# Altium project Ad - ESP-12F.PrjPcb
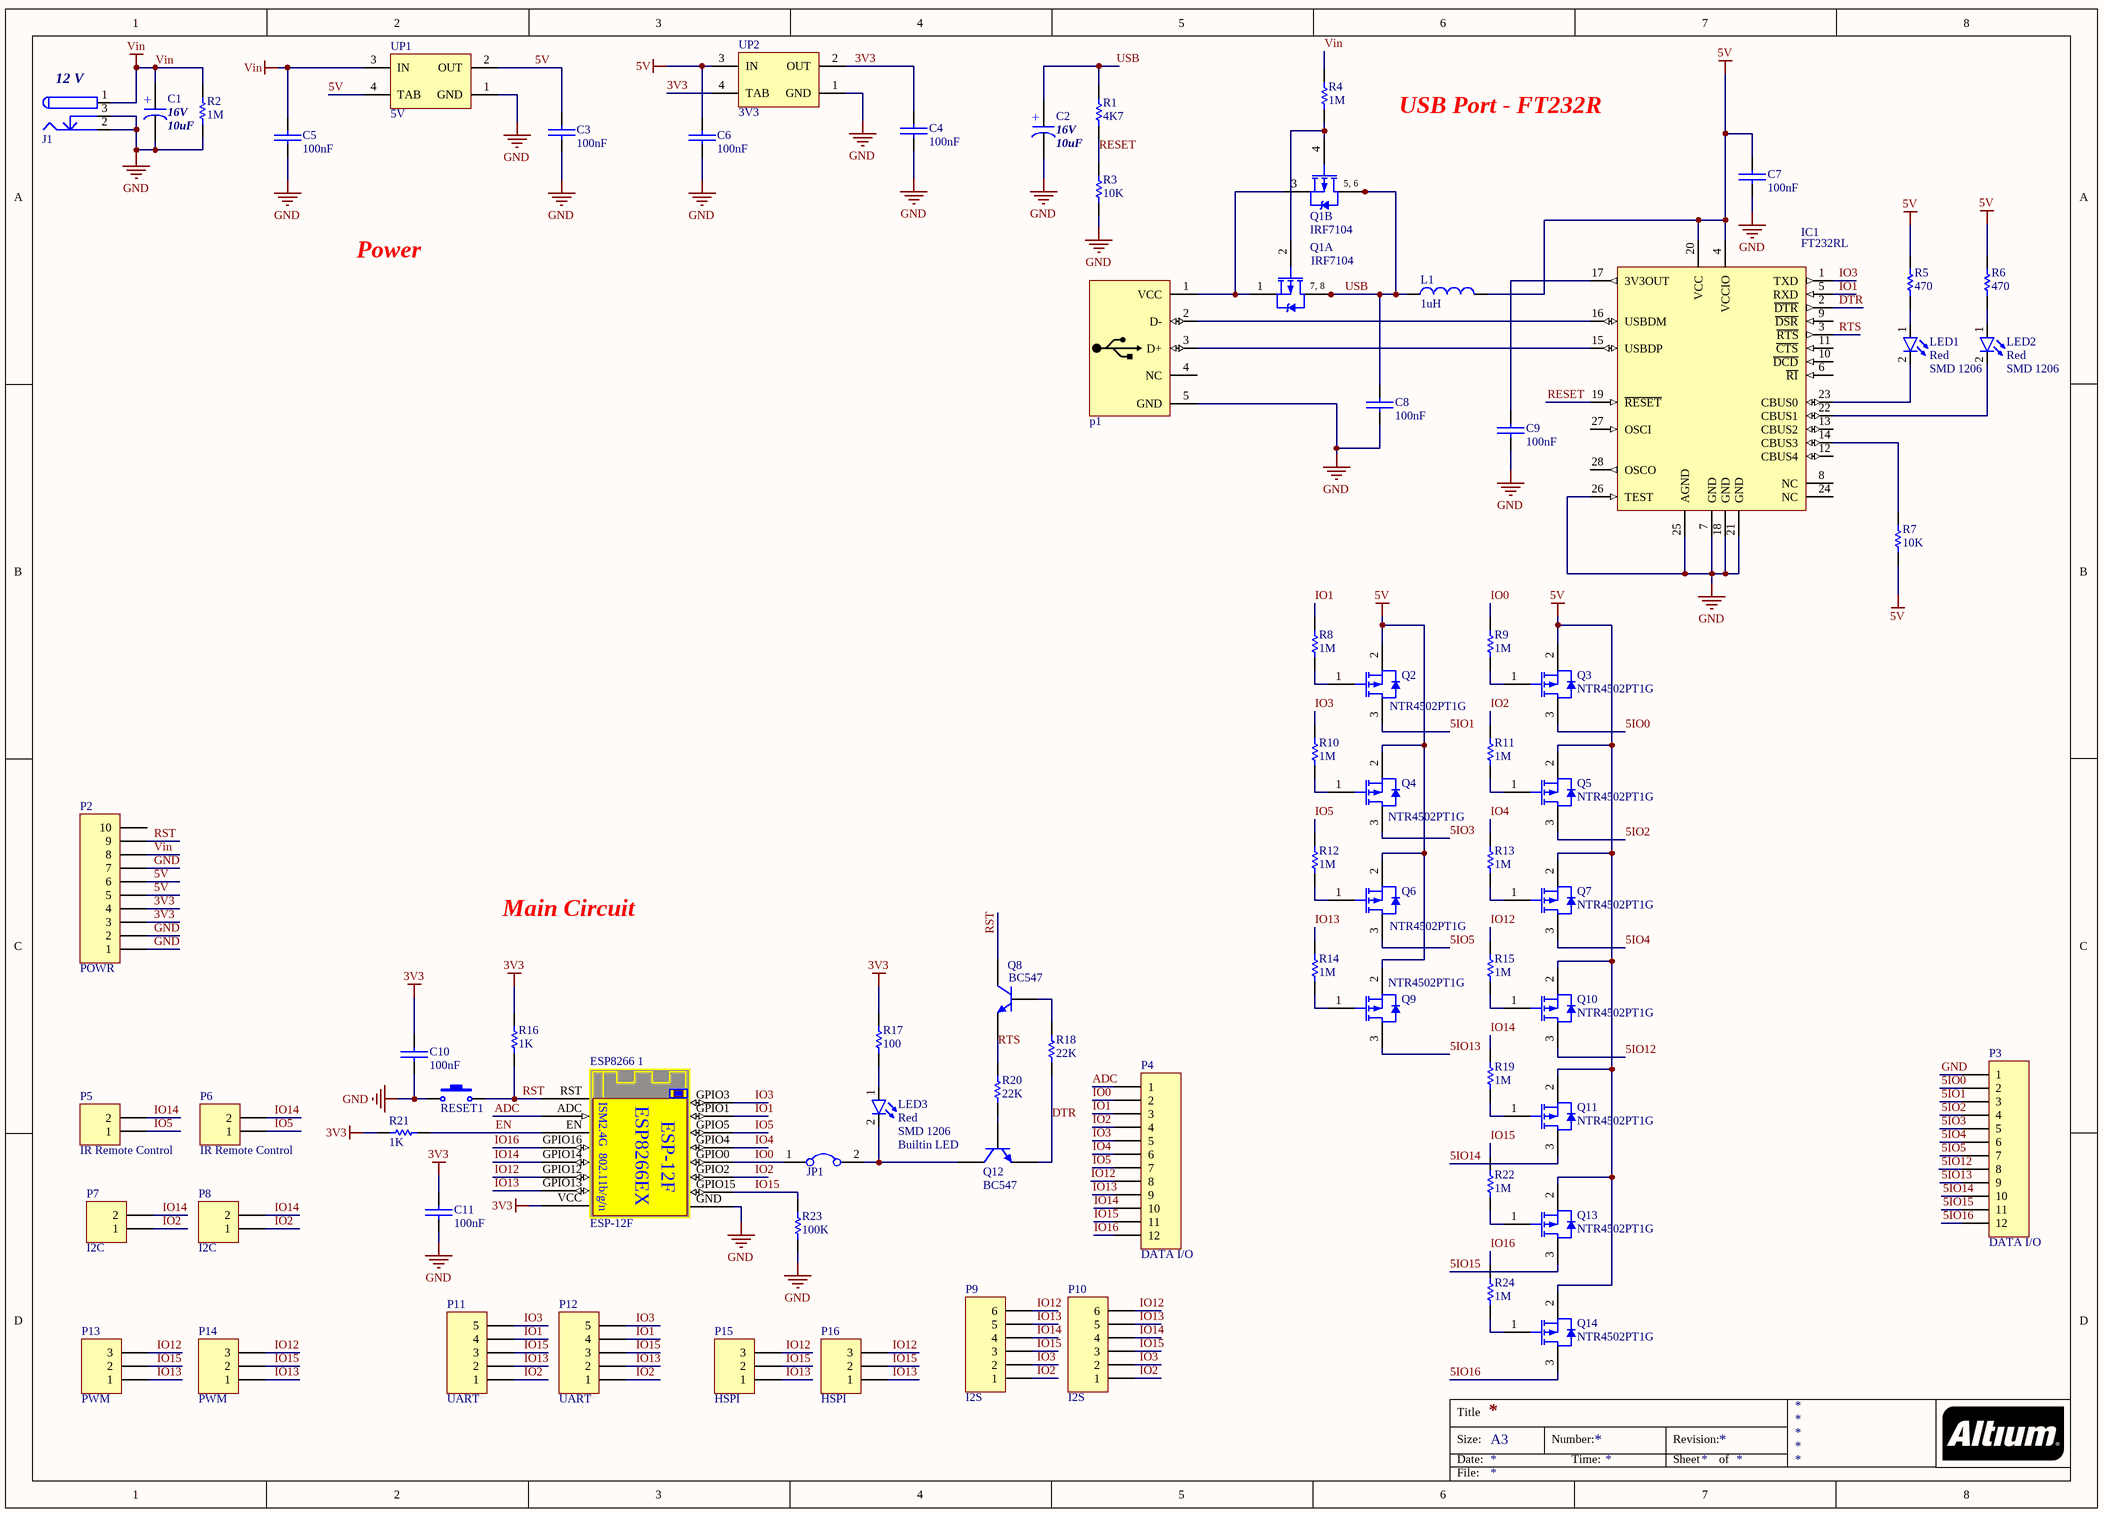
[diagram p0: Ad - ESP-12F.SchDoc]
1 sheet, 76 parts. Net scope: global (net labels, ports and power ports of the same name join across sheets).
Board file: Ad - ESP-12F.PcbDoc

## Sheet Ad - ESP-12F.SchDoc
size A3; ApprovedBy: Mohammad Sadr; Author: Mohammad Sadr

### Parts
C1  value 10uF  Voltage: 16V  [AECS]  (hidden comment: SMD Capacitors)
C2  value 10uF  Voltage: 16V  [AECS]  (hidden comment: SMD Capacitors)
C3  100nF  [SMD_CAP_1206]
C4  100nF  [SMD_CAP_1206]
C5  100nF  [SMD_CAP_1206]
C6  100nF  [SMD_CAP_1206]
C7  100nF  [SMD_CAP_1206]
C8  100nF  [SMD_CAP_1206]
C9  100nF  [SMD_CAP_1206]
C10  100nF  [SMD_CAP_1206]
C11  100nF  [SMD_CAP_1206]
ESP8266_1  ESP-12F  [ESP-12F]
IC1  FT232RL  [SSOP-28_M]
J1  DC Power Jack  [DC Power Jack 1]  (value not drawn)
JP1  Jumper  [Jumper Small - 2.54 - BLUE]  (value not drawn)
L1  1uH  [IND1206]
LED1  Size: SMD 1206  [LED SMD 1206]  (hidden comment: Red)
LED2  Size: SMD 1206  [LED SMD 1206]  (hidden comment: Red)
LED3  Size: SMD 1206  Type: Builtin LED  [LED SMD 1206]  (hidden comment: Red)
p1  USB Connector  [USB_AB_BM_SHS]  (value not drawn)
P2  POWR  [HDR1X10]
P3  DATA I/O  [HDR1X12]
P4  DATA I/O  [HDR1X12]
P5  IR Remote Control  [HDR1X2]
P6  IR Remote Control  [HDR1X2]
P7  I2C  [HDR1X2]
P8  I2C  [HDR1X2]
P9  I2S  [HDR1X6]
P10  I2S  [HDR1X6]
P11  UART  [HDR1X5]
P12  UART  [HDR1X5]
P13  PWM  [HDR1X3]
P14  PWM  [HDR1X3]
P15  HSPI  [HDR1X3]
P16  HSPI  [HDR1X3]
Q1  IRF7104  [SO-8_M]  (parts A,B of 2)
Q2  NTR4502PT1G  [ONSC-SOT-23-3-318-08_V]
Q3  NTR4502PT1G  [ONSC-SOT-23-3-318-08_V]
Q4  NTR4502PT1G  [ONSC-SOT-23-3-318-08_V]
Q5  NTR4502PT1G  [ONSC-SOT-23-3-318-08_V]
Q6  NTR4502PT1G  [ONSC-SOT-23-3-318-08_V]
Q7  NTR4502PT1G  [ONSC-SOT-23-3-318-08_V]
Q8  BC547  [SOT23_M]
Q9  NTR4502PT1G  [ONSC-SOT-23-3-318-08_V]
Q10  NTR4502PT1G  [ONSC-SOT-23-3-318-08_V]
Q11  NTR4502PT1G  [ONSC-SOT-23-3-318-08_V]
Q12  BC547  [SOT23_M]
Q13  NTR4502PT1G  [ONSC-SOT-23-3-318-08_V]
Q14  NTR4502PT1G  [ONSC-SOT-23-3-318-08_V]
R1  4K7  [RES1206 _(3216X08L)]
R2  1M  [RES1206 _(3216X08L)]
R3  10K  [RES1206 _(3216X08L)]
R4  1M  [RES1206 _(3216X08L)]
R5  470  [RES1206 _(3216X08L)]
R6  470  [RES1206 _(3216X08L)]
R7  10K  [RES1206 _(3216X08L)]
R8  1M  [RES1206 _(3216X08L)]
R9  1M  [RES1206 _(3216X08L)]
R10  1M  [RES1206 _(3216X08L)]
R11  1M  [RES1206 _(3216X08L)]
R12  1M  [RES1206 _(3216X08L)]
R13  1M  [RES1206 _(3216X08L)]
R14  1M  [RES1206 _(3216X08L)]
R15  1M  [RES1206 _(3216X08L)]
R16  1K  [RES1206 _(3216X08L)]
R17  100  [RES1206 _(3216X08L)]
R18  22K  [RES1206 _(3216X08L)]
R19  1M  [RES1206 _(3216X08L)]
R20  22K  [RES1206 _(3216X08L)]
R21  1K  [RES1206 _(3216X08L)]
R22  1M  [RES1206 _(3216X08L)]
R23  100K  [RES1206 _(3216X08L)]
R24  1M  [RES1206 _(3216X08L)]
RESET1  Switch PB  [SW-PB]  (value not drawn)
UP1  5V  [SOT223_M]
UP2  3V3  [SOT223_M]

### Nets
3V3: C4.1(+) C10.1(+) C11.1(+) ESP8266_1.VCC(Analog_Power_2.5V_~_3.6V) P2.3 P2.4 R16.2 R17.2 R21.2 UP2.2(OUT) UP2.4(TAB)
5V: C3.1(+) C6.2(-) C7.1(+) IC1.4(VCCIO) IC1.20(VCC) L1.2 P2.5 P2.6 Q2.2(S) Q3.2(S) Q4.2(S) Q5.2(S) Q6.2(S) Q7.2(S) Q9.2(S) Q10.2(S) Q11.2(S) Q13.2(S) Q14.2(S) R5.2 R6.2 R7.1 UP1.2(OUT) UP1.4(TAB) UP2.3(IN)
GND: C1.2 C2.2 C3.2(-) C4.2(-) C5.1(+) C6.1(+) C7.2(-) C8.1(+) C9.1(+) C10.2(-) C11.2(-) ESP8266_1.GND IC1.7(GND) IC1.18(GND) IC1.21(GND) IC1.25(AGND) IC1.26(TEST) J1.2 J1.3 p1.5(GND) P2.1 P2.2 P2.7 P3.1 R2.1 R3.1 R23.1 RESET1.1 UP1.1(GND) UP2.1(GND)
Vin: C1.1 C5.2(-) J1.1 P2.8 R2.2 R4.2 UP1.3(IN)
5IO0: P3.2 Q3.3(D)
5IO1: P3.3 Q2.3(D)
5IO2: P3.4 Q5.3(D)
5IO3: P3.5 Q4.3(D)
5IO4: P3.6 Q7.3(D)
5IO5: P3.7 Q6.3(D)
5IO12: P3.8 Q10.3(D)
5IO13: P3.9 Q9.3(D)
5IO14: P3.10 Q11.3(D)
5IO15: P3.11 Q13.3(D)
5IO16: P3.12 Q14.3(D)
ADC: ESP8266_1.ADC(A/D_Conversion_result.Input_voltage_range_0-1v,scope:0-1024) P4.1
DTR: IC1.2(~{DTR}) Q12.2(E) R18.1
EN: ESP8266_1.EN(Chip_enable_pin._Active_high) R21.1
IO0: ESP8266_1.GPIO0(SPI_CS2) JP1.1 P4.2 R9.2
IO1: ESP8266_1.GPIO1(UART_TX_during_?ash_programming;_SPI_CS1) IC1.5(RXD) P4.3 P11.4 P12.4 R8.1
IO2: ESP8266_1.GPIO2(UART_TX_during_?ash_programming) P4.4 P7.1 P8.1 P9.1 P10.1 P11.1 P12.1 R11.1
IO3: ESP8266_1.GPIO3(UART_Rx_during_?ash_programming) IC1.1(TXD) P4.5 P9.2 P10.2 P11.5 P12.5 R10.1
IO4: ESP8266_1.GPIO4 P4.6 R13.1
IO5: ESP8266_1.GPIO5 P4.7 P5.1 P6.1 R12.1
IO12: ESP8266_1.GPIO12(HSPI_MISO) P4.8 P9.6 P10.6 P13.3 P14.3 P15.3 P16.3 R15.1
IO13: ESP8266_1.GPIO13(HSPI_MOSI;_UART0_CTS) P4.9 P9.5 P10.5 P11.2 P12.2 P13.1 P14.1 P15.1 P16.1 R14.1
IO14: ESP8266_1.GPIO14(HSPI_CLK) P4.10 P5.2 P6.2 P7.2 P8.2 P9.4 P10.4 R19.1
IO15: ESP8266_1.GPIO15(HSPI_CS;_UART0_RTS) P4.11 P9.3 P10.3 P11.3 P12.3 P13.2 P14.2 P15.2 P16.2 R22.1 R23.2
IO16: ESP8266_1.GPIO16(XPD_DCDC_-_Deep-sleep_wakeup_(need_to_be_connected_to_EXT_RSTB)) P4.12 R24.1
RESET: IC1.19(~{RESET}) R1.1 R3.2
RST: ESP8266_1.RST(External_reset_signal_(Low_voltage_level:_active)) P2.9 Q8.3(C) R16.1 RESET1.2
RTS: IC1.3(~{RTS}) Q8.2(E) R20.2
USB: C2.1 C8.2(-) L1.1 Q1.5(D) Q1.6(D) Q1.7(D) Q1.8(D) R1.2
NetC9_2: C9.2(-) IC1.17(3V3OUT)
NetIC1_14: IC1.14(CBUS3) R7.2
NetIC1_15: IC1.15(USBDP) p1.3(D+)
NetIC1_16: IC1.16(USBDM) p1.2(D-)
NetIC1_22: IC1.22(CBUS1) LED2.2(K)
NetIC1_23: IC1.23(CBUS0) LED1.2(K)
NetJP1_2: JP1.2 LED3.2(K) Q12.3(C)
NetLED1_1: LED1.1(A) R5.1
NetLED2_1: LED2.1(A) R6.1
NetLED3_1: LED3.1(A) R17.1
Netp1_1: p1.1(VCC) Q1.1(S) Q1.3(S)
NetQ1_2: Q1.2(G) Q1.4(G) R4.1
NetQ2_1: Q2.1(G) R8.2
NetQ3_1: Q3.1(G) R9.1
NetQ4_1: Q4.1(G) R10.2
NetQ5_1: Q5.1(G) R11.2
NetQ6_1: Q6.1(G) R12.2
NetQ7_1: Q7.1(G) R13.2
NetQ8_1: Q8.1(B) R18.2
NetQ9_1: Q9.1(G) R14.2
NetQ10_1: Q10.1(G) R15.2
NetQ11_1: Q11.1(G) R19.2
NetQ12_1: Q12.1(B) R20.1
NetQ13_1: Q13.1(G) R22.2
NetQ14_1: Q14.1(G) R24.2

Not connected (* = marked no-connect by the designer): IC1 6(~{RI}) 8(NC) 9(~{DSR}) 10(~{DCD}) 11(~{CTS}) 12(CBUS4) 13(CBUS2) 24(NC) 27(OSCI) 28(OSCO); p1 4(NC); P2 10

### Notes on the sheet
- (near J1) 12 V
- USB Port - FT232R
- Power
- Main Circuit
- Title
- Size:
- Date:
- A3
- Number:
- Time:
- Revision:
- Sheet
- of
- File:
- (in symbol ESP-12F WiFi Module) ISM2.4G; ESP8266EX; 802.11b/g/n
- (in symbol IRF7104, part A) 7, 8
- (in symbol IRF7104, part B) 5, 6
- (in symbol SMD Capacitors) +

### Library data of the parts
C3-C11 = Cap-Bipolar: Bipolar Capacitor; Voltage: 100V; Designer: Saeid Jorablo; Organazation: ControTec; Adding Date: 1387/12/20; Value: 100nF
ESP8266_1 = ESP-12F WiFi Module
IC1 = FT232RL: USB UART Asynchronous Serial Data Transfer Chip, SSOP-28, Tape and Reel; Published: 19-Aug-2010; DatasheetVersion: ver 2.07, Jul-2010; PackageVersion: 2010; PackageReference: SSOP-28; Publisher: Altium Limited; PackageDescription: 28-Pin Small Outline Package 0.65 mm Pitch; ComponentLink1Description: Manufacturer Link; ComponentLink1URL: http://www.ftdichip.com/Products/ICs/FT232R.htm; ComponentLink2Description: Datasheet; ComponentLink2URL: http://www.ftdichip.com/Support/Documents/DataSheets/ICs/DS_FT232R.pdf
J1 = DC Power Jack: DC Power Jack. Center Pin 2.5mm. Diameter: 5.7mm; Designer: Ali Hafizi; Company: Personal; Project Name: Laser; Adding Date: 10/21/2009
JP1 = Jumper: Company: E.P.I.L; Defualt State: Close; Design Date: 2011/11/02
L1 = INDUCTOR SMD PACKAGE: TOTAL INDUCTOR SMD PACK; Designer: Abbas Basereh; Desc.: INDUCTOR  SMD TOTAL PACKAGES; Data: 2017-3-10; VALUE: 1uH
LED1-LED3 = LED: Designer: Saeid Jorablo; Organazation: ControTec; Adding Date: 1387/12/22; Color: Red
p1 = USB MICRO: USB Connector MICRO-B Type; Designer: ABBAS BASEREH; Max Current: 1600mA; Mounting Technology: Surface Mount\Through-Hole; Category: Connector; Pin Count: 5-7; Publisher: ABBAS BASEREH; Status: Unreleased; ComponentLink1Description: Datasheet; ComponentLink2Description: Reference; Update: 1395-11-17
P2 = Header 10: Header, 10-Pin; LatestRevisionDate: 17-Jul-2002; LatestRevisionNote: Re-released for DXP Platform.; Publisher: Altium Limited
P3 P4 = Header 12: Header, 12-Pin; LatestRevisionDate: 17-Jul-2002; LatestRevisionNote: Re-released for DXP Platform.; Publisher: Altium Limited
P5-P8 = Header 2: Header, 2-Pin; LatestRevisionDate: 17-Jul-2002; LatestRevisionNote: Re-released for DXP Platform.; Publisher: Altium Limited
P9 P10 = Header 6: Header, 6-Pin; LatestRevisionDate: 17-Jul-2002; LatestRevisionNote: Re-released for DXP Platform.; Publisher: Altium Limited
P11 P12 = Header 5: Header, 5-Pin; LatestRevisionDate: 17-Jul-2002; LatestRevisionNote: Re-released for DXP Platform.; Publisher: Altium Limited
P13-P16 = Header 3: Header, 3-Pin; LatestRevisionDate: 17-Jul-2002; LatestRevisionNote: Re-released for DXP Platform.; Publisher: Altium Limited
Q1 = IRF7104: HEXFET Power MOSFET; Published: 8-Jun-2000; LatestRevisionDate: 13-Apr-2006; LatestRevisionNote: IPC-7351 Footprint Added.; DatasheetVersion: Aug-1997; PackageVersion: Feb-2001; PackageReference: SO-8; Publisher: Altium Limited; PackageDescription: 8-Pin Plastic Small Outline Integrated Circuit 1.27 mm Pitch; Code_JEDEC: MS-012-AA; Code_IPC: SOIC127P600-8; ComponentLink1Description: Manufacturer Link; ComponentLink1URL: http://www.irf.com/; ComponentLink2Description: Datasheet; ComponentLink2URL: http://www.irf.com/product-info/datasheets/data/irf7104.pdf
Q2-Q7 Q9-Q11 Q13 Q14 = NTR4502PT1G: Power MOSFET, -30 V, -1.95 A, Single, P-Channel, 3-Pin SOT-23, Pb-Free, Tape and Reel; Manufacturer: On Semiconductor; Channel Polarity: P Channel; Ciss Typ (pF): 200; Coss Typ (pF): 80; Crss Typ (pF): 50; ID Max (A): 1.95; V(BR)DSS Min (V): 30; VGS Max (V): 20; VGS(th) Max (V): 3; DatasheetVersion: Rev. 5; PackageVersion: Rev. AP, 11/2009; PackageReference: SOT-23-3-318-08; PackageDescription: 3-Pin Small Outline Transistor, Body 2.92 x 1.3 mm, Pitch 0.95 mm; Supplier 1: Digi-Key; Supplier Part Number 1: NTR4502PT1GOSTR-ND; Supplier 2: Digi-Key; Supplier Part Number 2: NTR4502PT1GOSCT-ND; Supplier 3: Digi-Key; Supplier Part Number 3: NTR4502PT1GOSDKR-ND; Supplier 4: Farnell; Supplier Part Number 4: 1431308; Supplier 5: Farnell; Supplier Part Number 5: 1431308RL; Supplier 6: Newark; Supplier Part Number 6: 10N9589; Supplier 7: Newark; Supplier Part Number 7: 98H0966; Supplier 8: Mouser; Supplier Part Number 8: 863-NTR4502PT1G; Configuration: Single; Package Type: SOT-23-3; Packing: Tape and Reel; RoHS: Pb-Free; Mounting Technology: Surface Mount; PartNumber: NTR4502PT1G; ComponentLink1Description: Manufacturer URL; ComponentLink1URL: http://www.onsemi.com/; ComponentLink2Description: Datasheet; ComponentLink2URL: http://www.onsemi.cn/pub_link/Collateral/NTR4502P-D.PDF; ComponentLink3Description: Package Specification; ComponentLink3URL: http://www.onsemi.cn/pub_link/Collateral/318-08.PDF
Q8 Q12 = BC337: 45 V, 500 mA NPN general-purpose transistors; Published: 2017-2-8; LatestRevisionDate: 2017; LatestRevisionNote: IPC-7351 Footprint Added.; DatasheetVersion: 2017; PackageVersion: 2017-2-8; PackageReference: SOT23; Publisher: Abbas Basereh; PackageDescription: 3-Pin SOT-23 Package 0.95 mm Pitch, 2.3 mm Lead Span; ComponentLink1Description: Manufacturer Link; ComponentLink1URL: http://www.nxp.com/; ComponentLink2Description: Datasheet; ComponentLink2URL: http://www.nxp.com/
R1-R24 = RES SMD PACKAGE: TOTAL SMD RESISTOR PACK; Designer: Abbas Basereh; Desc.: RES SMD PAKAGES; Data: 2017-3-10
RESET1 = Switch PB: Push Button Switch
UP1 UP2 = AMS1117-x.x: x.x Volt, 800mA Low-Dropout Linear Regulator, 4-pin SOT-223; Designer: Ali Hafizi; Data: 16-12-2016